# Altium schematic sheet PHY.SCHDOC
size B
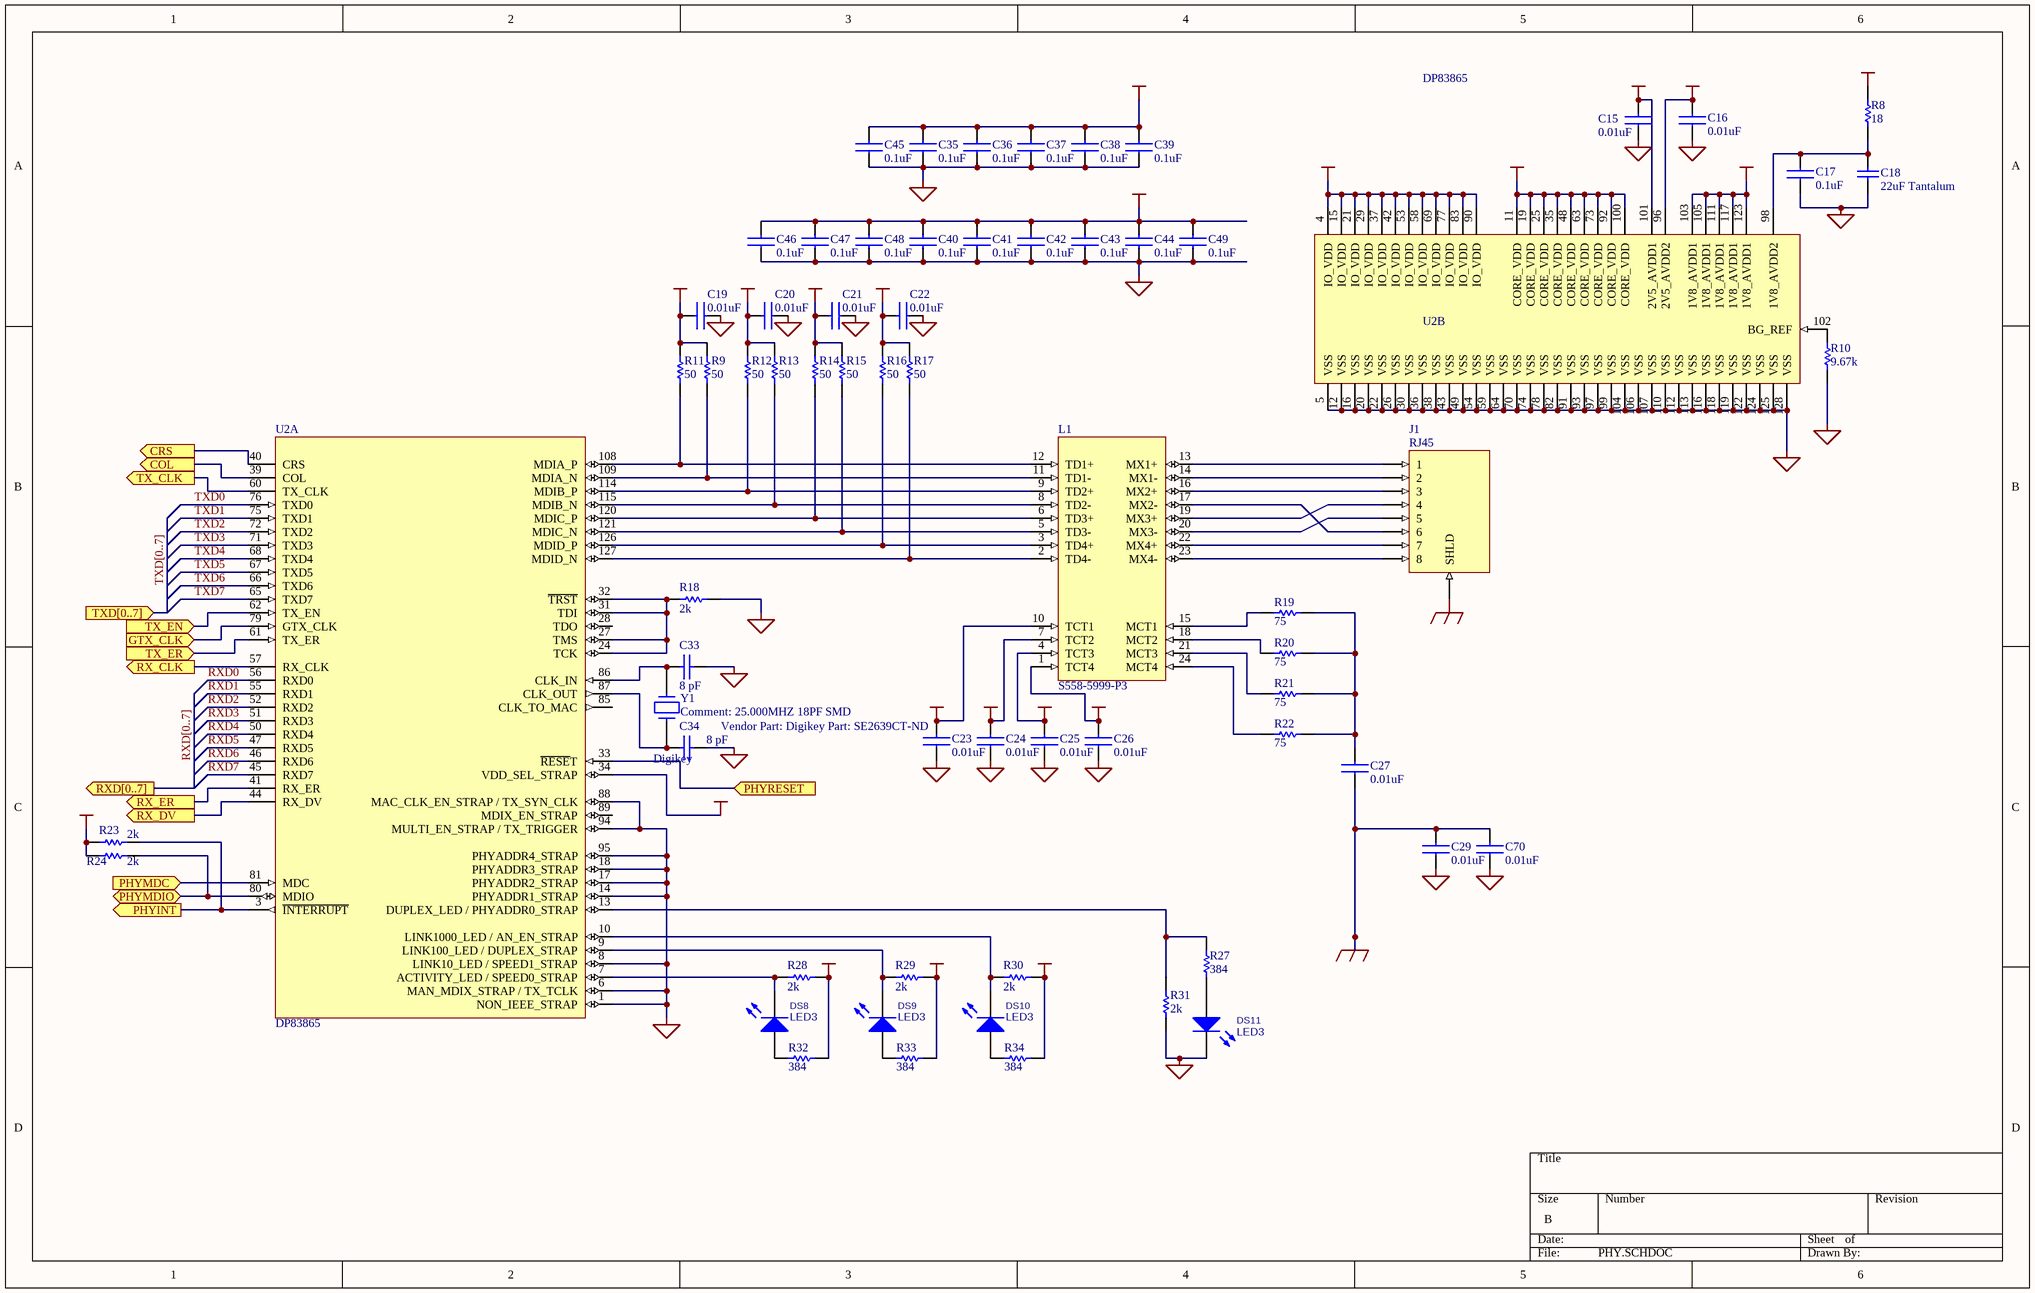
[diagram p0: PHY.SCHDOC]

## Parts
C15  value 0.01uF  [0402]  (hidden comment: CAPACITOR)
C16  value 0.01uF  [0402]  (hidden comment: CAPACITOR)
C17  value 0.1uF  [0603]  (hidden comment: CAPACITOR)
C18  value 22uF Tantalum  [TC7343-2917]  (hidden comment: Cap)
C19  value 0.01uF  [0402]  (hidden comment: CAPACITOR)
C20  value 0.01uF  [0402]  (hidden comment: CAPACITOR)
C21  value 0.01uF  [0402]  (hidden comment: CAPACITOR)
C22  value 0.01uF  [0402]  (hidden comment: CAPACITOR)
C23  value 0.01uF  [0402]  (hidden comment: CAPACITOR)
C24  value 0.01uF  [0402]  (hidden comment: CAPACITOR)
C25  value 0.01uF  [0402]  (hidden comment: CAPACITOR)
C26  value 0.01uF  [0402]  (hidden comment: CAPACITOR)
C27  value 0.01uF  [0402]  (hidden comment: CAPACITOR)
C29  value 0.01uF  [0402]  (hidden comment: CAPACITOR)
C33  8 pF  [0603]
C34  8 pF  [0603]
C35  value 0.1uF  [0603]  (hidden comment: CAPACITOR)
C36  value 0.1uF  [0603]  (hidden comment: CAPACITOR)
C37  value 0.1uF  [0603]  (hidden comment: CAPACITOR)
C38  value 0.1uF  [0603]  (hidden comment: CAPACITOR)
C39  value 0.1uF  [0603]  (hidden comment: CAPACITOR)
C40  value 0.1uF  [0603]  (hidden comment: CAPACITOR)
C41  value 0.1uF  [0603]  (hidden comment: CAPACITOR)
C42  value 0.1uF  [0603]  (hidden comment: CAPACITOR)
C43  value 0.1uF  [0603]  (hidden comment: CAPACITOR)
C44  value 0.1uF  [0603]  (hidden comment: CAPACITOR)
C45  value 0.1uF  [0603]  (hidden comment: CAPACITOR)
C46  value 0.1uF  [0603]  (hidden comment: CAPACITOR)
C47  value 0.1uF  [0603]  (hidden comment: CAPACITOR)
C48  value 0.1uF  [0603]  (hidden comment: CAPACITOR)
C49  value 0.1uF  [0603]  (hidden comment: CAPACITOR)
C70  value 0.01uF  [0402]  (hidden comment: CAPACITOR)
DS8  LED3  [SMD _LED]
DS9  LED3  [SMD _LED]
DS10  LED3  [SMD _LED]
DS11  LED3  [SMD _LED]
J1  RJ45  [MOLEXRJ45_44050-0007]
L1  S558-5999-P3  [S558-5999-P3]
R8  value 18  [0603]  (hidden comment: Res1)
R9  value 50  [0603]  (hidden comment: RESISTOR)
R10  value 9.67k  [0603]  (hidden comment: Res1)
R11  value 50  [0603]  (hidden comment: RESISTOR)
R12  value 50  [0603]  (hidden comment: RESISTOR)
R13  value 50  [0603]  (hidden comment: RESISTOR)
R14  value 50  [0603]  (hidden comment: RESISTOR)
R15  value 50  [0603]  (hidden comment: RESISTOR)
R16  value 50  [0603]  (hidden comment: RESISTOR)
R17  value 50  [0603]  (hidden comment: RESISTOR)
R18  value 2k  [0603]  (hidden comment: RESISTOR)
R19  value 75  [0603]  (hidden comment: Res1)
R20  value 75  [0603]  (hidden comment: Res1)
R21  value 75  [0603]  (hidden comment: Res1)
R22  value 75  [0603]  (hidden comment: Res1)
R23  value 2k  [0603]  (hidden comment: RESISTOR)
R24  value 2k  [0603]  (hidden comment: RESISTOR)
R27  value 384  [0603]  (hidden comment: Res1)
R28  value 2k  [0603]  (hidden comment: RESISTOR)
R29  value 2k  [0603]  (hidden comment: RESISTOR)
R30  value 2k  [0603]  (hidden comment: RESISTOR)
R31  value 2k  [0603]  (hidden comment: RESISTOR)
R32  value 384  [0603]  (hidden comment: Res1)
R33  value 384  [0603]  (hidden comment: Res1)
R34  value 384  [0603]  (hidden comment: Res1)
U2  DP83865  [PQFP128RECT]  (parts A,B of 2)
Y1  25.000MHZ 18PF SMD  Vendor Part: Digikey Part: SE2639CT-ND  Vendor: Digikey  [EPSON_MA-506]

## Ports
COL (out), CRS (out), GTX_CLK (in), PHYINT (out), PHYMDC (in), PHYMDIO (bidir), PHYRESET (in), RX_CLK (out), RX_DV (out), RX_ER (out), RXD[0..7] (out), TX_CLK (out), TX_EN (in), TX_ER (in), TXD[0..7] (in)

## Nets
+1.8VCC: C40.1 C41.1 C42.1 C43.1 C44.1 C46.1 C47.1 C48.1 C49.1 R8.2 U2.11(CORE_VDD) U2.19(CORE_VDD) U2.25(CORE_VDD) U2.35(CORE_VDD) U2.48(CORE_VDD) U2.63(CORE_VDD) U2.73(CORE_VDD) U2.92(CORE_VDD) U2.100(CORE_VDD) U2.103(1V8_AVDD1) U2.105(1V8_AVDD1) U2.111(1V8_AVDD1) U2.117(1V8_AVDD1) U2.123(1V8_AVDD1)
+2.5VPHY: C15.2 C16.2 C19.1 C20.1 C21.1 C22.1 C23.2 C24.2 C25.2 C26.2 L1.1(TCT4) L1.4(TCT3) L1.7(TCT2) L1.10(TCT1) R9.2 R11.2 R12.2 R13.2 R14.2 R15.2 R16.2 R17.2 U2.96(2V5_AVDD2) U2.101(2V5_AVDD1)
CGND: C27.1 C29.2 C70.2 J1.9(SHLD)
GND: C15.1 C16.1 C17.1 C18.1 C19.2 C20.2 C21.2 C22.2 C23.1 C24.1 C25.1 C26.1 C29.1 C33.2 C34.2 C35.2 C36.2 C37.2 C38.2 C39.2 C40.2 C41.2 C42.2 C43.2 C44.2 C45.2 C46.2 C47.2 C48.2 C49.2 C70.1 DS11.2(K) R10.1 R18.2 R31.1 U2.1(NON_IEEE_STRAP) U2.5(VSS) U2.6(MAN_MDIX_STRAP_/_TX_TCLK) U2.8(LINK10_LED_/_SPEED1_STRAP) U2.12(VSS) U2.14(PHYADDR1_STRAP) U2.16(VSS) U2.17(PHYADDR2_STRAP) U2.18(PHYADDR3_STRAP) U2.20(VSS) U2.22(VSS) U2.26(VSS) U2.30(VSS) U2.36(VSS) U2.38(VSS) U2.43(VSS) U2.49(VSS) U2.54(VSS) U2.59(VSS) U2.64(VSS) U2.70(VSS) U2.74(VSS) U2.78(VSS) U2.82(VSS) U2.88(MAC_CLK_EN_STRAP_/_TX_SYN_CLK) U2.91(VSS) U2.93(VSS) U2.94(MULTI_EN_STRAP_/_TX_TRIGGER) U2.95(PHYADDR4_STRAP) U2.97(VSS) U2.99(VSS) U2.104(VSS) U2.106(VSS) U2.107(VSS) U2.110(VSS) U2.112(VSS) U2.113(VSS) U2.116(VSS) U2.118(VSS) U2.119(VSS) U2.122(VSS) U2.124(VSS) U2.125(VSS) U2.128(VSS)
VCC: C35.1 C36.1 C37.1 C38.1 C39.1 C45.1 R23.1 R24.1 R28.2 R29.2 R30.2 R32.2 R33.2 R34.2 U2.4(IO_VDD) U2.15(IO_VDD) U2.21(IO_VDD) U2.29(IO_VDD) U2.34(VDD_SEL_STRAP) U2.37(IO_VDD) U2.42(IO_VDD) U2.53(IO_VDD) U2.58(IO_VDD) U2.69(IO_VDD) U2.77(IO_VDD) U2.83(IO_VDD) U2.90(IO_VDD)
COL: U2.39(COL) ; port COL
CRS: U2.40(CRS) ; port CRS
GTX_CLK: U2.79(GTX_CLK) ; port GTX_CLK
PHYINT: R23.2 U2.3(~{INTERRUPT}) ; port PHYINT
PHYMDC: U2.81(MDC) ; port PHYMDC
PHYMDIO: R24.2 U2.80(MDIO) ; port PHYMDIO
PHYRESET: U2.33(~{RESE}T) ; port PHYRESET
RX_CLK: U2.57(RX_CLK) ; port RX_CLK
RX_DV: U2.44(RX_DV) ; port RX_DV
RX_ER: U2.41(RX_ER) ; port RX_ER
RXD0: U2.56(RXD0)
RXD1: U2.55(RXD1)
RXD2: U2.52(RXD2)
RXD3: U2.51(RXD3)
RXD4: U2.50(RXD4)
RXD5: U2.47(RXD5)
RXD6: U2.46(RXD6)
RXD7: U2.45(RXD7)
TX_CLK: U2.60(TX_CLK) ; port TX_CLK
TX_EN: U2.62(TX_EN) ; port TX_EN
TX_ER: U2.61(TX_ER) ; port TX_ER
TXD0: U2.76(TXD0)
TXD1: U2.75(TXD1)
TXD2: U2.72(TXD2)
TXD3: U2.71(TXD3)
TXD4: U2.68(TXD4)
TXD5: U2.67(TXD5)
TXD6: U2.66(TXD6)
TXD7: U2.65(TXD7)
NetC17_2: C17.2 C18.2 R8.1 U2.98(1V8_AVDD2)
NetC27_2: C27.2 R19.1 R20.1 R21.1 R22.1
NetC33_1: C33.1 U2.86(CLK_IN) Y1.1
NetC34_1: C34.1 U2.87(CLK_OUT) Y1.2
NetDS8_1: DS8.1(A) R32.1
NetDS8_2: DS8.2(K) R28.1 U2.7(ACTIVITY_LED_/_SPEED0_STRAP)
NetDS9_1: DS9.1(A) R33.1
NetDS9_2: DS9.2(K) R29.1 U2.9(LINK100_LED_/_DUPLEX_STRAP)
NetDS10_1: DS10.1(A) R34.1
NetDS10_2: DS10.2(K) R30.1 U2.10(LINK1000_LED_/_AN_EN_STRAP)
NetDS11_1: DS11.1(A) R27.1
NetJ1_1: J1.1 L1.13(MX1+)
NetJ1_2: J1.2 L1.14(MX1-)
NetJ1_3: J1.3 L1.16(MX2+)
NetJ1_4: J1.4 L1.19(MX3+)
NetJ1_5: J1.5 L1.20(MX3-)
NetJ1_6: J1.6 L1.17(MX2-)
NetJ1_7: J1.7 L1.22(MX4+)
NetJ1_8: J1.8 L1.23(MX4-)
NetL1_2: L1.2(TD4-) R17.1 U2.127(MDID_N)
NetL1_3: L1.3(TD4+) R16.1 U2.126(MDID_P)
NetL1_5: L1.5(TD3-) R15.1 U2.121(MDIC_N)
NetL1_6: L1.6(TD3+) R14.1 U2.120(MDIC_P)
NetL1_8: L1.8(TD2-) R13.1 U2.115(MDIB_N)
NetL1_9: L1.9(TD2+) R12.1 U2.114(MDIB_P)
NetL1_11: L1.11(TD1-) R9.1 U2.109(MDIA_N)
NetL1_12: L1.12(TD1+) R11.1 U2.108(MDIA_P)
NetL1_15: L1.15(MCT1) R19.2
NetL1_18: L1.18(MCT2) R20.2
NetL1_21: L1.21(MCT3) R21.2
NetL1_24: L1.24(MCT4) R22.2
NetR10_2: R10.2 U2.102(BG_REF)
NetR18_1: R18.1 U2.24(TCK) U2.27(TMS) U2.31(TDI) U2.32(~{TRST})
NetR27_2: R27.2 R31.2 U2.13(DUPLEX_LED_/_PHYADDR0_STRAP)

Not connected (* = marked no-connect by the designer): U2 28(TDO) 85(CLK_TO_MAC) 89(MDIX_EN_STRAP)

## Buses and harness runs
bus RXD[0..7] = port RXD[0..7]
bus TXD[0..7] = port TXD[0..7]

## Library data of the parts
C15-C17 C19-C27 C29 C35-C49 C70 = CAPACITOR: Standard Capacitor
C18 = Cap: Capacitor; Manufacturer: Generic Components; Class I: Passive; Published: 8-Jun-2000; Revision: July-2002: Re-released for DXP Platform.; Publisher: Altium Limited; Class II: Capacitor
C33 C34 = CAP: Capacitor
DS8-DS11 = LED3: Typical BLUE SiC LED; Published: 8-Jun-2000; LatestRevisionDate: 17-Dec-2003; LatestRevisionNote: PCB Footprint replaced.; Publisher: Altium Limited
J1 = RJ45: RJ-45 connector
L1 = S558-5999-P3: BEL 1000base-T magnetics S588-5999-P3
R8 R10 R19-R22 R27 R32-R34 = Res1: Resistor; Manufacturer: Generic Components; Class I: Passive; Published: 8-Jun-2000; Revision: July-2002: Re-released for DXP Platform.; Publisher: Altium Limited; Class II: Resistor
R9 R11-R18 R23 R24 R28-R31 = RESISTOR: Standard Passive Resistor; Tolerance: 1%
U2 = DP83865: National Semiconductor Gigabit PHY
Y1 = CRYSTAL: Crystal MA-506 25.000M-C0